# EAGLE design tritiled_module (EAGLE 8.2.2)
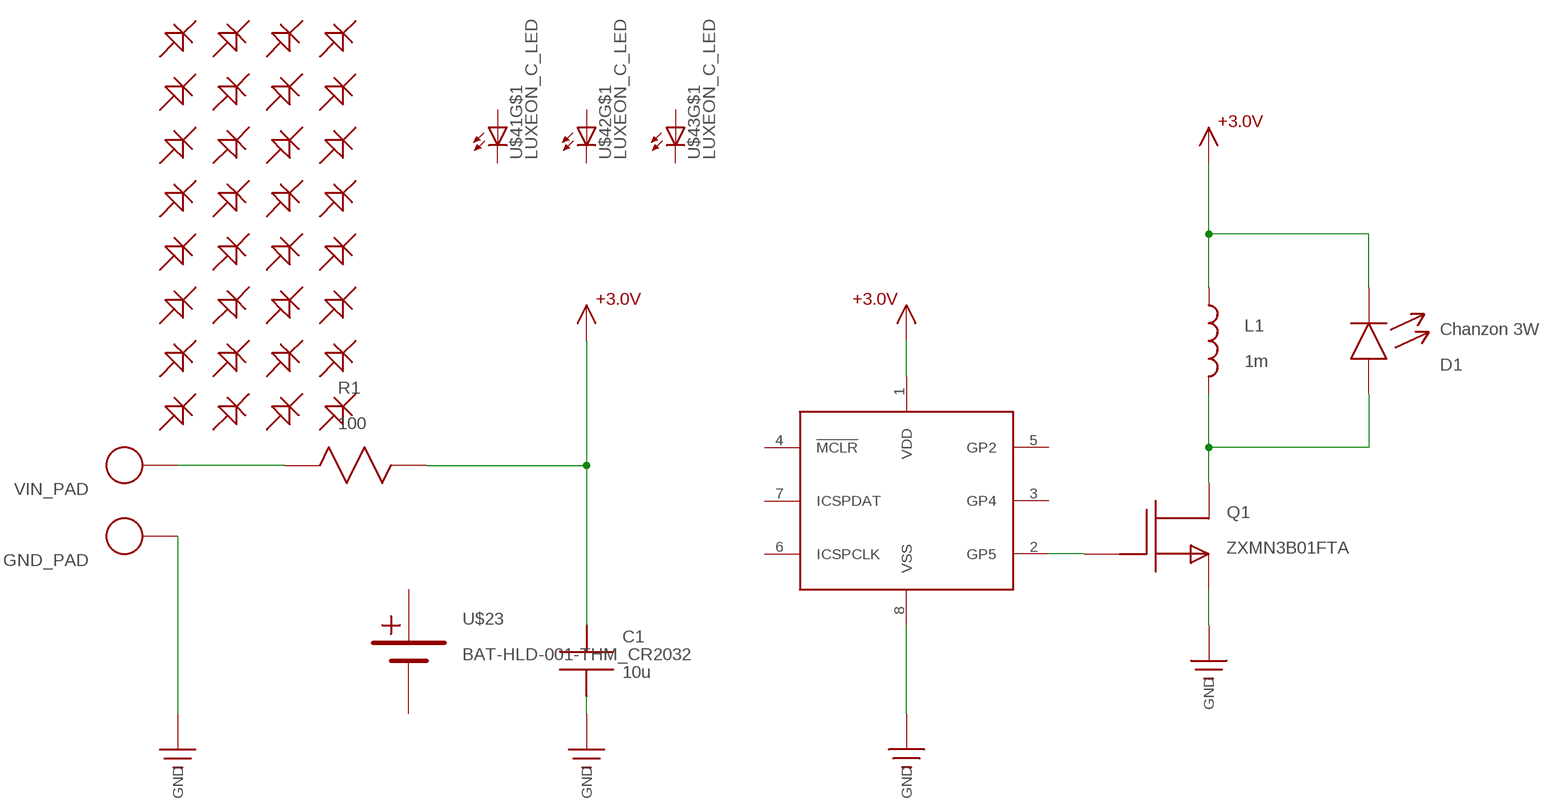
[diagram p0: schematic, sheet 1]

## Parts
C1  10u  C1206  [1206]
D1  Chanzon 3W  LED_3W  [LED_3W]
GND_PAD  ICSP_PAD  [ICSP_PAD]
L1  1m  SRR6028_INDUCTOR  [SRR6028_INDUCTOR]
Q1  ZXMN3B01FTA  ZXMN3B01FSOT23  [SOT-23]
R1  100  R1206  [R1206]
U1  PIC12LF1571  [SOIC8]
U$1  LED_0603  [LED_0603]
U$5  LED_0603  [LED_0603]
U$6  LED_0603  [LED_0603]
U$7  LED_0603  [LED_0603]
U$8  LED_0603  [LED_0603]
U$9  LED_0603  [LED_0603]
U$10  LED_0603  [LED_0603]
U$12  LED_0603  [LED_0603]
U$16  LED_0603  [LED_0603]
U$17  LED_0603  [LED_0603]
U$18  LED_0603  [LED_0603]
U$19  LED_0603  [LED_0603]
U$20  LED_0603  [LED_0603]
U$21  LED_0603  [LED_0603]
U$22  LED_0603  [LED_0603]
U$23  BAT-HLD-001-THM_CR2032  [CR2032_BAT-HLD-001-THM]
U$24  LED_0603  [LED_0603]
U$25  LED_0603  [LED_0603]
U$26  LED_0603  [LED_0603]
U$27  LED_0603  [LED_0603]
U$28  LED_0603  [LED_0603]
U$29  LED_0603  [LED_0603]
U$30  LED_0603  [LED_0603]
U$31  LED_0603  [LED_0603]
U$32  LED_0603  [LED_0603]
U$33  LED_0603  [LED_0603]
U$34  LED_0603  [LED_0603]
U$35  LED_0603  [LED_0603]
U$36  LED_0603  [LED_0603]
U$37  LED_0603  [LED_0603]
U$38  LED_0603  [LED_0603]
U$39  LED_0603  [LED_0603]
U$40  LED_0603  [LED_0603]
U$41  LUXEON_C_LED  [LUXEON_C]
U$42  LUXEON_C_LED  [LUXEON_C]
U$43  LUXEON_C_LED  [LUXEON_C]
VIN_PAD  ICSP_PAD  [ICSP_PAD]

## Nets
+3V: C1.P$1 D1.C L1.P$1 R1.P$2 U1.1(VDD) ; supply symbol labelled +3.0V
GND: C1.P$2 GND_PAD.P$2 Q1.2(S) U1.8(VSS)
N$1: R1.P$1 VIN_PAD.P$2
N$5: D1.A L1.P$2 Q1.3(D)
N$8: Q1.1(G) U1.2(GP5)
Unconnected: U1.3(GP4) U1.4(!MCLR!) U1.5(GP2) U1.6(ICSPCLK) U1.7(ICSPDAT) U$1.A U$1.C U$5.A U$5.C U$6.A U$6.C U$7.A U$7.C U$8.A U$8.C U$9.A U$9.C U$10.A U$10.C U$12.A U$12.C U$16.A U$16.C U$17.A U$17.C U$18.A U$18.C U$19.A U$19.C U$20.A U$20.C U$21.A U$21.C U$22.A U$22.C U$24.A U$24.C U$25.A U$25.C U$26.A U$26.C U$27.A U$27.C U$28.A U$28.C U$29.A U$29.C U$30.A U$30.C U$31.A U$31.C U$32.A U$32.C U$33.A U$33.C U$34.A U$34.C U$35.A U$35.C U$36.A U$36.C U$37.A U$37.C U$38.A U$38.C U$39.A U$39.C U$40.A U$40.C U$41.A U$41.C U$41.HS U$42.A U$42.C U$42.HS U$43.A U$43.C U$43.HS

## Power pins joined to a net without a drawn wire
0V: U$23.GND(0V)
+V: U$23.+V@1(+V) U$23.+V@2(+V) U$23.+V@3(+V) U$23.+V@4(+V)

## Library data of the parts
C1 = tritiled:C
D1 = tritiled:LED_3W
GND_PAD VIN_PAD = tritiled:ICSP_PAD
L1 = tritiled:SRR6028_INDUCTOR
Q1 = tritiled:ZXMN3B01F
R1 = tritiled:R
U1 = tritiled:PIC12LF1571
U$1 U$5-U$10 U$12 U$16-U$22 U$24-U$40 = led_oscilloscope:LED_0603
U$23 = tritiled:BAT-HLD-001-THM_CR2032
U$41-U$43 = z0:LUXEON_C_LED

## Board
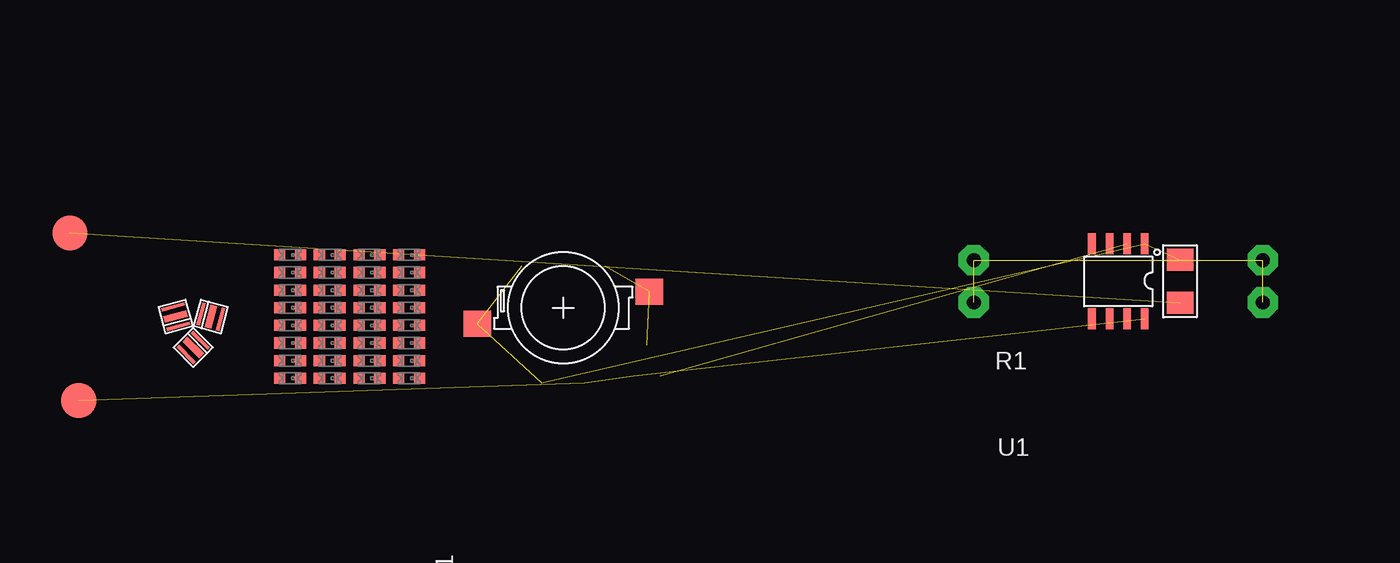
[diagram p1: board, top side]
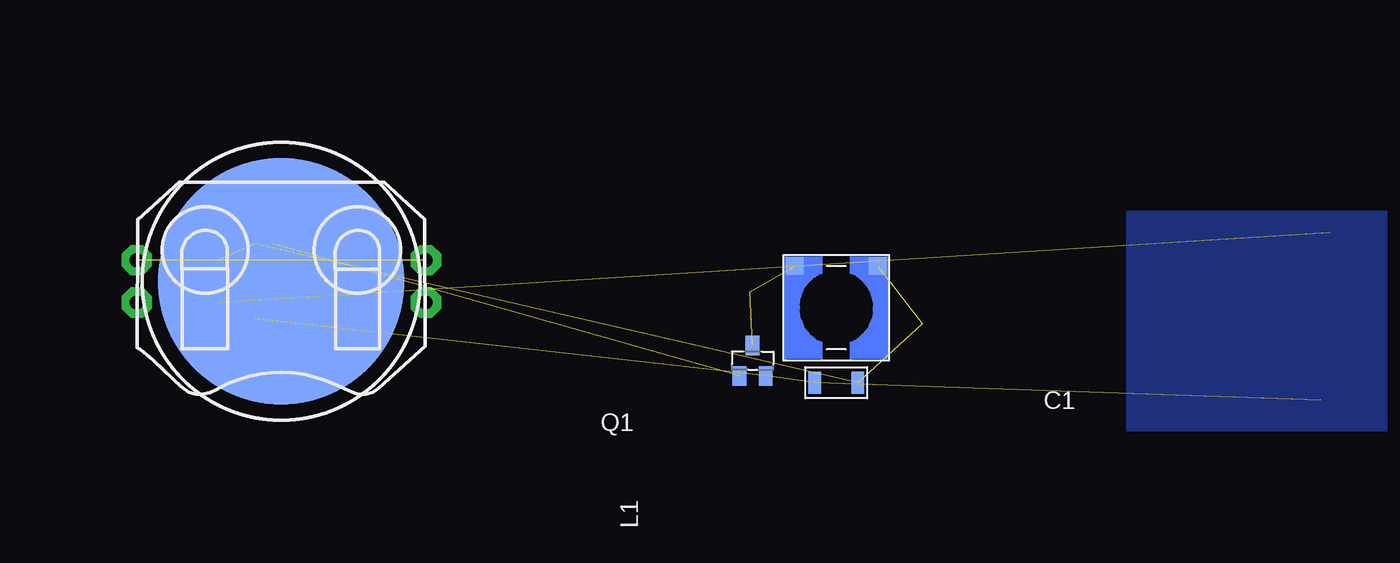
[diagram p2: board, bottom side, seen from below]

No outline drawn. Coordinates in mm, seen from the top.
Copper layers (1*16): Top 0.0356mm / dielectric 1.5011mm / Bottom 0.0356mm
Design rules "LaenPCBOrder_tented_vias": minimum track width 6mil, minimum drill 13mil, track to track 6mil, track to pad 6mil, pad to pad 6mil, via to via 6mil, smd to smd 6mil, copper to edge 15mil, drill to drill 6mil, minimum pad ring 7mil, minimum via ring 7mil, stop-mask expansion 3mil, vias tented up to drill 16mil, thermal gap 10mil

### Footprints (pad centres in the part's own frame; a part is rotated, then mirrored left to right if it is on the bottom)
1206 = smd 0.9 x 1.6: P$1 -1.55,0; P$2 1.55,0
LED_3W = smd 2 x 1.9: A 6.2,1.15; C -6.2,-1.15
ICSP_PAD = smd 2.54 x 2.54: P$2 0,0
SRR6028_INDUCTOR = smd 1.27 x 1.27: P$1 -3,3; P$2 -3,-3
SOT-23 = smd 1 x 1.4: 1 -0.95,-1.1; 2 0.95,-1.1; 3 0,1.1
R1206 = smd 1.6 x 1.9: P$1 -1.55,0; P$2 1.55,0
SOIC8 = smd 0.55 x 1.5: 1 -1.905,-2.7; 2 -0.635,-2.7; 3 0.635,-2.7; 4 1.905,-2.7; 5 1.905,2.7; 6 0.635,2.7; 7 -0.635,2.7; 8 -1.905,2.7
LED_0603 = smd 0.8 x 0.8: A -0.75,0; C 0.75,0
CR2032_BAT-HLD-001-THM = drill 1 pad 2.184 octagon: +V@1 -10.414,1.524; +V@2 -10.414,-1.524; +V@3 10.414,-1.524; +V@4 10.414,1.524 | smd 17.78 x 17.78: GND 0,0
LUXEON_C = smd 0.25 x 1.7: A -0.725,0; C 0.725,0 | smd 0.5 x 1.7: HS 0,0

### Placement (x,y rotation side)
C1  48.9,9.84 180 bottom
D1  48.9,15.24 0 top
GND_PAD  13.97,8.57 0 top
L1  48.9,15.24 270 bottom
Q1  54.93,11.43 0 bottom
R1  93.34,17.14 90 top
U1  88.9,17.14 180 top
U$1  32.07,19.05 0 top
U$5  32.07,17.78 0 top
U$6  32.07,16.51 0 top
U$7  34.92,19.05 0 top
U$8  34.92,17.78 0 top
U$9  34.92,16.51 0 top
U$10  32.07,15.24 0 top
U$12  34.92,15.24 0 top
U$16  37.78,19.05 0 top
U$17  37.78,17.78 0 top
U$18  37.78,16.51 0 top
U$19  37.78,15.24 0 top
U$20  32.07,13.97 0 top
U$21  34.92,13.97 0 top
U$22  37.78,13.97 0 top
U$23  88.9,17.14 0 bottom
U$24  32.07,12.7 0 top
U$25  34.92,12.7 0 top
U$26  37.78,12.7 0 top
U$27  32.07,11.43 0 top
U$28  34.92,11.43 0 top
U$29  37.78,11.43 0 top
U$30  32.07,10.16 0 top
U$31  34.92,10.16 0 top
U$32  37.78,10.16 0 top
U$33  29.21,19.05 0 top
U$34  29.21,17.78 0 top
U$35  29.21,16.51 0 top
U$36  29.21,15.24 0 top
U$37  29.21,13.97 0 top
U$38  29.21,12.7 0 top
U$39  29.21,11.43 0 top
U$40  29.21,10.16 0 top
U$41  20.95,14.61 285 top
U$42  22.23,12.38 45 top
U$43  23.5,14.61 165 top
VIN_PAD  13.34,20.64 0 top

### Tracks (layer width: path | path; a pad name or v marks a point on that pad's centre or on a via)
+3V  (4 unrouted)
+V  (3 unrouted)
GND  (3 unrouted)
  pour Bottom: 9.21,22.23 9.21,6.35 27.94,6.35 27.94,22.23
N$1  (1 unrouted)
N$5  (2 unrouted)
N$8  (1 unrouted)